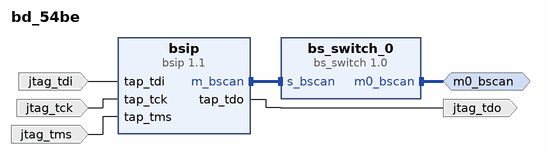
[diagram p0: block diagram of the top level]
# Vivado block design bd_54be, xc7vx690tffg1927-2, Vivado 2020.1.1_AR73018
create_bd_design bd_54be

create_bd_intf_port -mode Master -vlnv xilinx.com:interface:bscan_rtl:1.0 m0_bscan
create_bd_port -dir I jtag_tdi
create_bd_port -dir O jtag_tdo
create_bd_port -dir I jtag_tms
create_bd_port -dir I jtag_tck

create_bd_cell -type ip -vlnv xilinx.com:ip:bsip:1.1 bsip
set_property -dict [list \
  CONFIG.C_CHIP_ID 0 \
  CONFIG.C_DEVICE_FAMILY 0 \
  CONFIG.C_EN_MUX 0 \
  CONFIG.C_EN_MUX_EXT_BS 0 \
  CONFIG.C_IR_ID_INSTR 0 \
  CONFIG.C_IR_USER1_INSTR 0 \
  CONFIG.C_IR_WIDTH 0 \
  CONFIG.C_USER_SCAN_CHAIN 1 \
  CONFIG.C_USE_SOFTBSCAN 1 \
] [get_bd_cells bsip]
create_bd_cell -type ip -vlnv xilinx.com:ip:bs_switch:1.0 bs_switch_0
set_property -dict {CONFIG.C_NUM_BS_MASTER 1 CONFIG.C_USER_SCAN_CHAIN 1 CONFIG.C_USE_EXT_BSCAN true} [get_bd_cells bs_switch_0]

# ---- connections ----

connect_bd_intf_net [get_bd_intf_pins bsip/m_bscan] [get_bd_intf_pins bs_switch_0/s_bscan]
connect_bd_intf_net [get_bd_intf_ports m0_bscan] [get_bd_intf_pins bs_switch_0/m0_bscan]
connect_bd_net [get_bd_ports jtag_tdi] [get_bd_pins bsip/tap_tdi]
connect_bd_net [get_bd_pins bsip/tap_tdo] [get_bd_ports jtag_tdo]
connect_bd_net [get_bd_ports jtag_tck] [get_bd_pins bsip/tap_tck]
connect_bd_net [get_bd_ports jtag_tms] [get_bd_pins bsip/tap_tms]

validate_bd_design
save_bd_design
